# Altium schematic sheet STM32F103C8T6 Minimum system.SchDoc
size A4
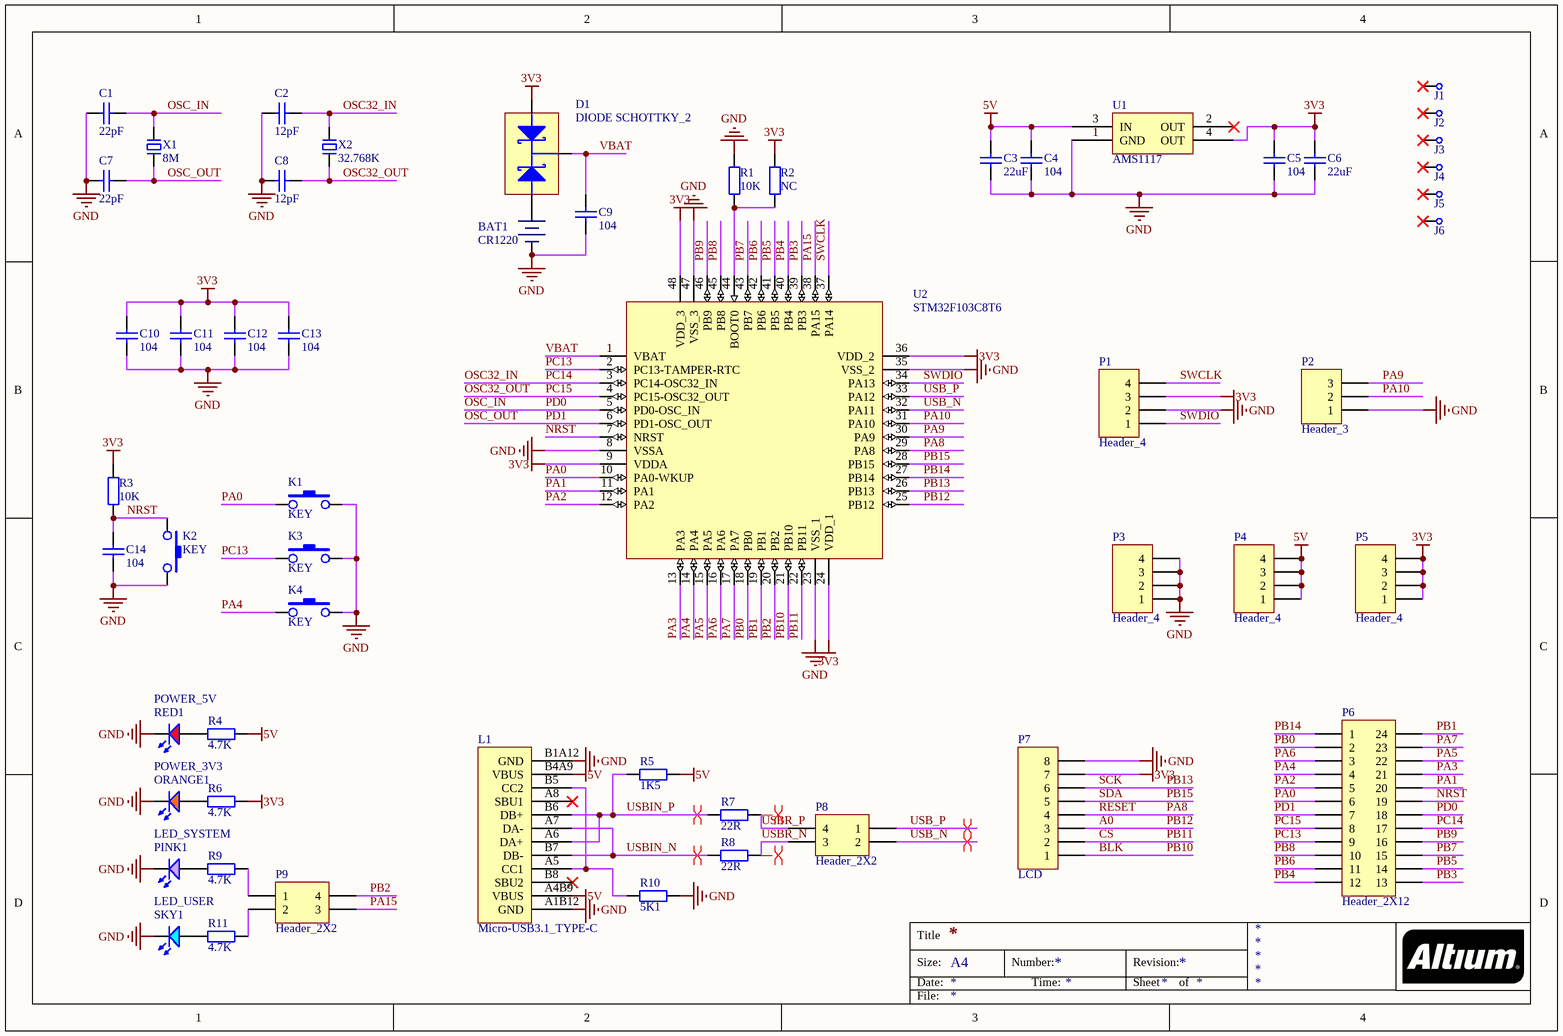
[diagram p0: STM32F103C8T6 Minimum system.SchDoc]

## Parts
BAT1  CR1220  [CR1220-B]
C1  22pF  [Cap-0603]
C2  12pF  [Cap-0603]
C3  22uF  [Cap-0805]
C4  104  [Cap-0603]
C5  104  [Cap-0603]
C6  22uF  [Cap-0805]
C7  22pF  [Cap-0603]
C8  12pF  [Cap-0603]
C9  104  [Cap-0603]
C10  104  [Cap-0603]
C11  104  [Cap-0603]
C12  104  [Cap-0603]
C13  104  [Cap-0603]
C14  104  [Cap-0603]
D1  DIODE SCHOTTKY_2  [SOT23-3]
J1  HOLE_2mm  [HOLE_2mm_1]  (value not drawn)
J2  HOLE_2mm  [HOLE_2mm_1]  (value not drawn)
J3  HOLE_2mm  [HOLE_2mm_1]  (value not drawn)
J4  HOLE_2mm  [HOLE_2mm_1]  (value not drawn)
J5  HOLE_2mm  [HOLE_2mm_1]  (value not drawn)
J6  HOLE_2mm  [HOLE_2mm_1]  (value not drawn)
K1  KEY  [SW-SMD-3X4X2.5]
K2  KEY  [SW-SMD-3X4X2.5]
K3  KEY  [SW-SMD-3X4X2.5]
K4  KEY  [SW-SMD-3X4X2.5]
L1  Micro-USB3.1_TYPE-C  [USB3.0-TYPEC-12P]
ORANGE1  POWER_3V3  [LED_0603_Y]
P1  Header_4  [Header 2.54X4]
P2  Header_3  [Header 2.54X3]
P3  Header_4  [Header 2.54X4]
P4  Header_4  [Header 2.54X4]
P5  Header_4  [Header 2.54X4]
P6  Header_2X12  [Header 2.54_2X12]
P7  LCD  [Header 2.54X8]
P8  Header_2X2  [Header 2.54_2X2]
P9  Header_2X2  [Header 2.54_2X2]
PINK1  LED_SYSTEM  [LED_0603_R]
R1  10K  [Res-0603]
R2  NC  [Res-0603]
R3  10K  [Res-0603]
R4  4.7K  [Res-0603]
R5  1K5  [Res-0603]
R6  4.7K  [Res-0603]
R7  22R  [Res-0603]
R8  22R  [Res-0603]
R9  4.7K  [Res-0603]
R10  5K1  [Res-0603]
R11  4.7K  [Res-0603]
RED1  POWER_5V  [LED_0603_R]
SKY1  LED_USER  [LED_0603_B]
U1  AMS1117  [AMS1117]
U2  STM32F103C8T6  [STM32F103C8T6]
X1  8M  [OSC 5032-2P]
X2  32.768K  [OSC 3215-2P]

## Nets
3V3: C5.2 C6.2 C10.2 C11.2 C12.2 C13.2 D1.1 P1.3 P5.1 P5.2 P5.3 P5.4 P7.7 R2.2 R3.2 R6.2 U1.4(OUT) U2.9(VDDA) U2.24(VDD_1) U2.36(VDD_2) U2.48(VDD_3)
5V: C3.2 C4.2 L1.A4B9(VBUS) L1.B4A9(VBUS) P4.1 P4.2 P4.3 P4.4 R4.2 R5.1 U1.3(IN)
GND: BAT1.2 C1.1 C2.1 C3.1 C4.1 C5.1 C6.1 C7.1 C8.1 C9.1 C10.1 C11.1 C12.1 C13.1 C14.1 K1.3 K2.3 K3.3 K4.3 L1.A1B12(GND) L1.B1A12(GND) ORANGE1.2(K) P1.2 P2.1 P3.1 P3.2 P3.3 P3.4 P7.8 PINK1.2(K) R1.2 R10.1 RED1.2(K) SKY1.2(K) U1.1(GND) U2.8(VSSA) U2.23(VSS_1) U2.35(VSS_2) U2.47(VSS_3)
A0: P7.3 U2.25(PB12)  [also labelled PB12]
BLK: P7.1 U2.21(PB10)  [also labelled PB10]
CS: P7.2 U2.22(PB11)  [also labelled PB11]
NRST: C14.2 K2.1 P6.19 R3.1 U2.7(NRST)
OSC32_IN: C2.2 P6.17 U2.3(PC14-OSC32_IN) X2.2  [also labelled PC14]
OSC32_OUT: C8.2 P6.8 U2.4(PC15-OSC32_OUT) X2.1  [also labelled PC15]
OSC_IN: C1.2 P6.18 U2.5(PD0-OSC_IN) X1.2  [also labelled PD0]
OSC_OUT: C7.2 P6.7 U2.6(PD1-OSC_OUT) X1.1  [also labelled PD1]
PA0: K1.1 P6.6 U2.10(PA0-WKUP)
PA1: P6.20 U2.11(PA1)
PA2: P6.5 U2.12(PA2)
PA3: P6.21 U2.13(PA3)
PA4: K4.1 P6.4 U2.14(PA4)
PA5: P6.22 U2.15(PA5)
PA6: P6.3 U2.16(PA6)
PA7: P6.23 U2.17(PA7)
PA8: P7.4 U2.29(PA8)  [also labelled RESET]
PA9: P2.3 U2.30(PA9)
PA10: P2.2 U2.31(PA10)
PA15: P9.3 U2.38(PA15)
PB0: P6.2 U2.18(PB0)
PB1: P6.24 U2.19(PB1)
PB2: P9.4 U2.20(PB2)
PB3: P6.13 U2.39(PB3)
PB4: P6.12 U2.40(PB4)
PB5: P6.14 U2.41(PB5)
PB6: P6.11 U2.42(PB6)
PB7: P6.15 U2.43(PB7)
PB8: P6.10 U2.45(PB8)
PB9: P6.16 U2.46(PB9)
PB13: P7.6 U2.26(PB13)  [also labelled SCK]
PB14: P6.1 U2.27(PB14)
PB15: P7.5 U2.28(PB15)  [also labelled SDA]
PC13: K3.1 P6.9 U2.2(PC13-TAMPER-RTC)
SWCLK: P1.4 U2.37(PA14)
SWDIO: P1.1 U2.34(PA13)
USB_N: P8.2 U2.32(PA11)
USB_P: P8.1 U2.33(PA12)
USBIN_N: L1.A7(DA-) L1.B7(DB-) R8.2
USBIN_P: L1.A6(DA+) L1.B6(DB+) R5.2 R7.2
USBR_N: P8.3 R8.1
USBR_P: P8.4 R7.1
VBAT: C9.2 D1.3 U2.1(VBAT)
NetBAT1_1: BAT1.1 D1.2
NetL1_A5: L1.A5(CC1) L1.B5(CC2) R10.2
NetORANGE1_1: ORANGE1.1(A) R6.1
NetP9_1: P9.1 R9.2
NetP9_2: P9.2 R11.2
NetPINK1_1: PINK1.1(A) R9.1
NetR1_1: R1.1 R2.1 U2.44(BOOT0)
NetR4_1: R4.1 RED1.1(A)
NetR11_1: R11.1 SKY1.1(A)

Not connected (* = marked no-connect by the designer): J1 1*; J2 1*; J3 1*; J4 1*; J5 1*; J6 1*; L1 A8(SBU1)* B8(SBU2)*; U1 2(OUT)*

## Layout directives
differential pair: USB_N, USB_P, USBIN_N, USBIN_P, USBR_N, USBR_P

## Notes on the sheet
- Title
- Size:
- Date:
- A4
- Number:
- Time:
- Revision:
- Sheet
- of
- File:

## Library data of the parts
BAT1 = CR1220: 纽扣电池座
C1-C14 = CAP: 贴片陶瓷电容
D1 = DIODE SCHOTTKY_2: 双肖特基二极管
J1-J6 = HOLE_2mm: 定位孔
ORANGE1 = LED_SMD_ORANGE: 发光二极管; ComponentLink1Description: 供应商链接; ComponentLink1URL: http://www.szlcsc.com/product/details_73147.html; Package: 0603; Supplier: LC; SuppliersPartNumber: C72038
P7 = Header_8
PINK1 = LED_SMD_PINK: 发光二极管; ComponentLink1Description: 供应商链接; ComponentLink1URL: http://www.szlcsc.com/product/details_2659.html; Package: 0603; Supplier: LC; SuppliersPartNumber: C2286
R1-R11 = RES: 贴片电阻
RED1 = LED_SMD_RED: 发光二极管; ComponentLink1Description: 供应商链接; ComponentLink1URL: http://www.szlcsc.com/product/details_2659.html; Package: 0603; Supplier: LC; SuppliersPartNumber: C2286
SKY1 = LED_SMD_BLUE_SKY: 发光二极管; ComponentLink1Description: 供应商链接; ComponentLink1URL: http://www.szlcsc.com/product/details_73150.html; Package: 0603; Supplier: LC; SuppliersPartNumber: C72041
U2 = STM32F103C8T6: ARM Cortex-M3 32-bit MCU, 64 KB Flash, 20 KB Internal RAM, 37 I/Os, 48-pin LQFP, -40 to 85 degC, Tray; A/D Converter: 2x12-bit (10 Channel); FLASH Size (Prog) (kB): 64; I/Os (High Current): 37; Internal RAM Size (kB): 20; Operating Frequency(F) (Processor speed) (MHz): 72; Supply Voltage(Vcc) min (V): 2; DatasheetVersion: Rev. 16; PackageVersion: Rev. 6, 06/2013; PackageReference: LQFP48; PackageDescription: 48-Pin Low Profile Quad Flat Package, 7 x 7 mm Body, 0.5 mm Pitch; Supplier 1: Digi-Key; Supplier Part Number 1: 497-6063-ND; Supplier 2: Farnell; Supplier Part Number 2: 1447637; Supplier 3: Newark; Supplier Part Number 3: 59M2182; Supplier 4: Newark; Supplier Part Number 4: 57P1222; Supplier 5: Mouser; Supplier Part Number 5: 511-STM32F103C8T6; Core: ARM Cortex-M3; Packing: Tray; Mounting Technology: Surface Mount; PartNumber: STM32F103C8T6; ComponentLink1Description: Manufacturer URL; ComponentLink1URL: http://www.st.com/web/en/home.html; ComponentLink2Description: Datasheet; ComponentLink2URL: http://www.st.com/st-web-ui/static/active/en/resource/technical/document/datasheet/CD00161566.pdf; ComponentLink3Description: Package Specification; ComponentLink3URL: http://www.st.com/st-web-ui/static/active/en/resource/technical/document/datasheet/DM00058181.pdf
X1 X2 = XTAL-2P: 2脚无源脚晶振